# EAGLE schematic punchdriver (EAGLE 6.6.0)

## Sheet 1 of 6
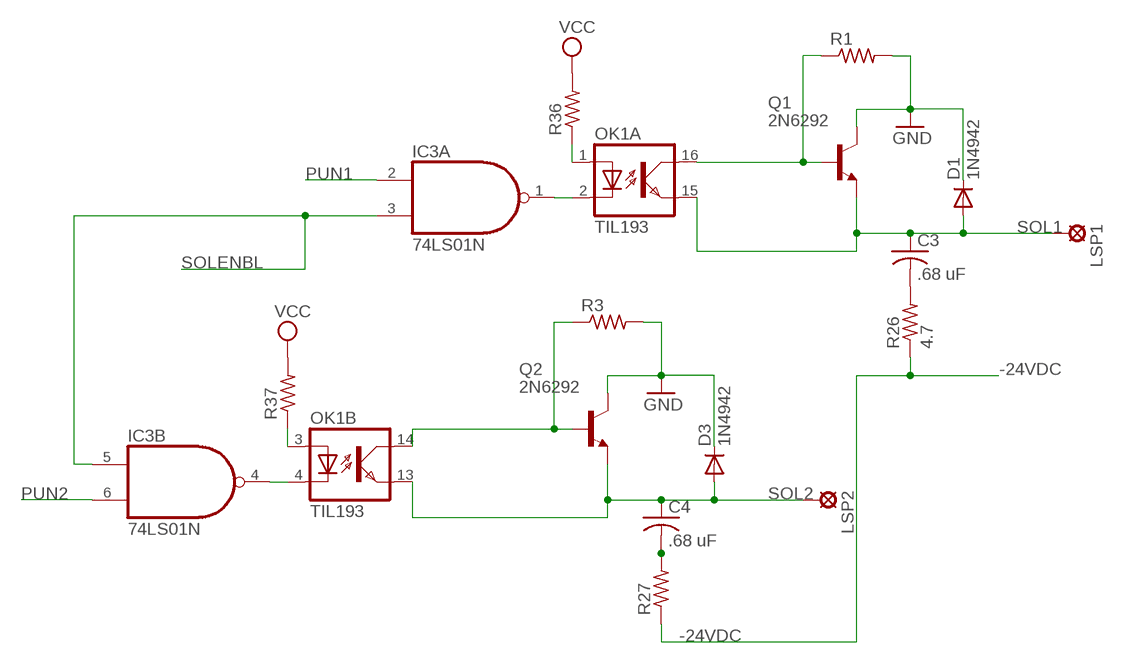
[diagram p0: schematic, sheet 1]

### Parts
C3  .68 uF  C-US050-025X075  [C050-025X075]
C4  .68 uF  C-US050-025X075  [C050-025X075]
D1  1N4942  [DO41-10]
D3  1N4942  [DO41-10]
IC3  74LS01N  [DIL14]
LSP1  SE13  [SE13]
LSP2  SE13  [SE13]
OK1  TIL193  [DIL16]
Q1  2N6292  [TO220]
Q2  2N6292  [TO220]
R1  R-US_0207/10  [0207/10]
R3  R-US_0207/10  [0207/10]
R26  4.7  R-US_0207/10  [0207/10]
R27  R-US_0207/10  [0207/10]
R36  R-US_0207/10  [0207/10]
R37  R-US_0207/10  [0207/10]

### Nets
-24VDC: R26.1 R27.1 ; also sheet 2,3,4,5
GND: D1.C D3.C Q1.2(C) Q2.2(C) R1.2 R3.2 ; also sheet 2,3,4,5,6
N$3: OK1.16(A:COL) Q1.1(B) R1.1
N$4: OK1.14(B:COL) Q2.1(B) R3.1
N$15: C3.2 R26.2
N$18: C4.2 R27.2
N$27: IC3.1(A:O) OK1.2(A:C)
N$28: IC3.4(B:O) OK1.4(B:C)
N$29: OK1.1(A:A) R36.1
N$30: OK1.3(B:A) R37.1
PUN1: IC3.2(A:I0) ; also sheet 6
PUN2: IC3.6(B:I1) ; also sheet 6
SOL1: C3.1 D1.A LSP1.MP OK1.15(A:EMIT) Q1.3(E)
SOL2: C4.1 D3.A LSP2.MP OK1.13(B:EMIT) Q2.3(E)
SOLENBL: IC3.3(A:I1) IC3.5(B:I0) ; also sheet 2,3,4,5
VCC: R36.2 R37.2 ; also sheet 2,3,4,5

## Sheet 2 of 6
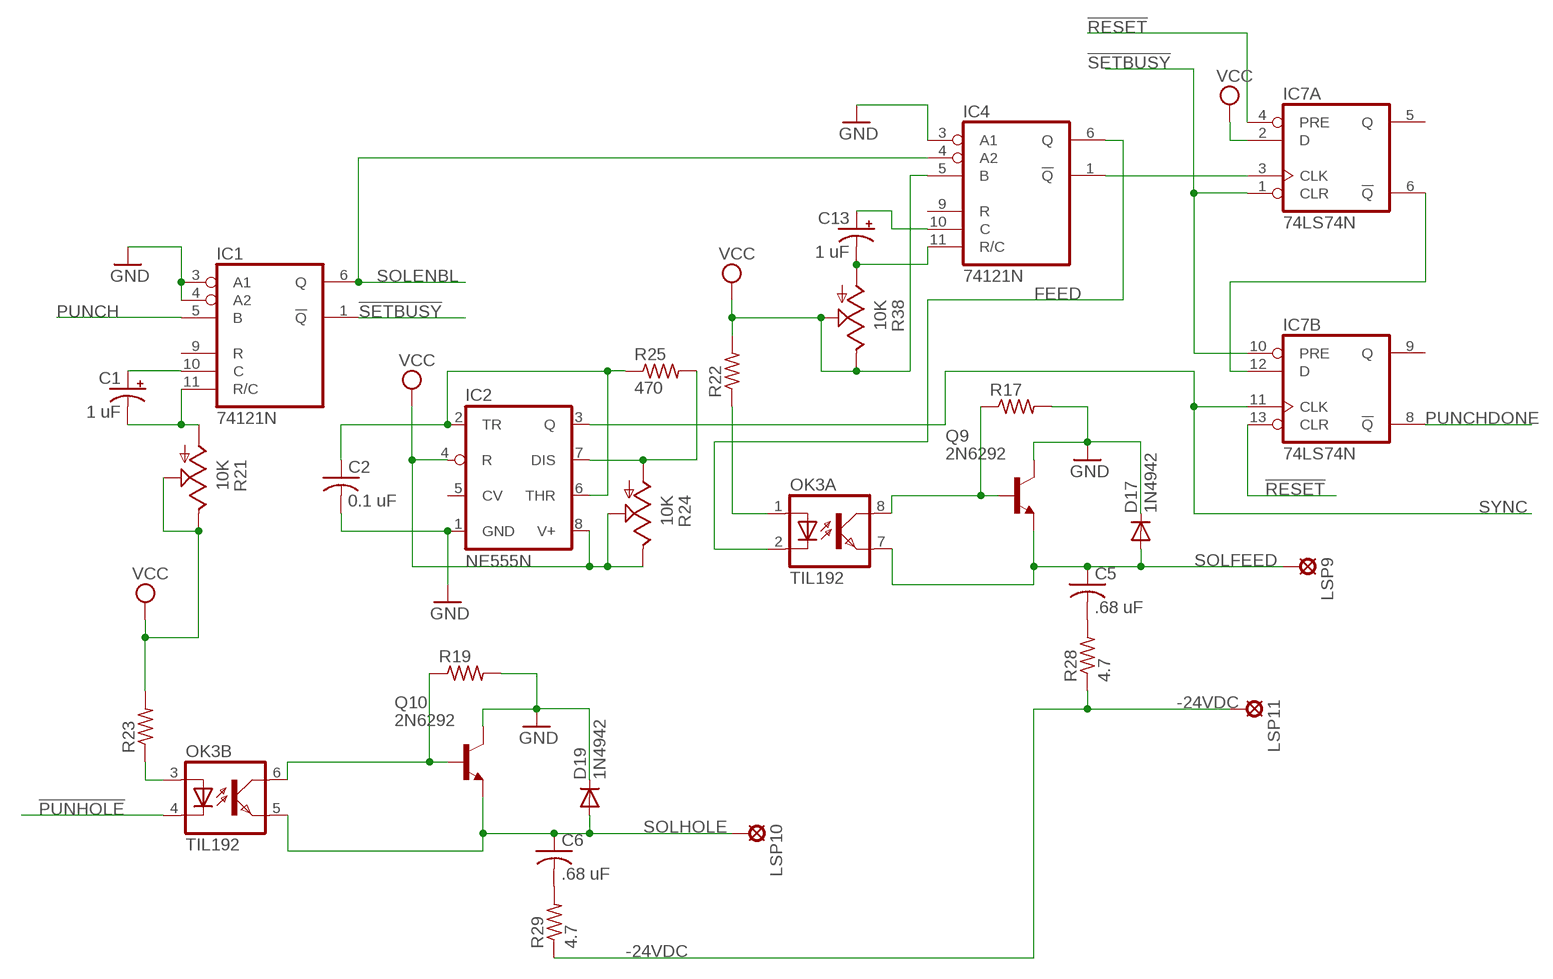
[diagram p1: schematic, sheet 2]

### Parts
C1  1 uF  CPOL-USB45181A  [B45181A]
C2  0.1 uF  C-US050-025X075  [C050-025X075]
C5  .68 uF  C-US050-025X075  [C050-025X075]
C6  .68 uF  C-US050-025X075  [C050-025X075]
C13  1 uF  CPOL-USB45181A  [B45181A]
D17  1N4942  [DO41-10]
D19  1N4942  [DO41-10]
IC1  74121N  [DIL14]
IC2  NE555N  [DIL08]
IC4  74121N  [DIL14]
IC7  74LS74N  [DIL14]
LSP9  SE13  [SE13]
LSP10  SE13  [SE13]
LSP11  SE13  [SE13]
OK3  TIL192  [DIL08]
Q9  2N6292  [TO220]
Q10  2N6292  [TO220]
R17  R-US_0207/10  [0207/10]
R19  R-US_0207/10  [0207/10]
R21  10K  TRIM_US-PTSPIN  [PT-SPIN]
R22  R-US_0207/10  [0207/10]
R23  R-US_0207/10  [0207/10]
R24  10K  TRIM_US-PTSPIN  [PT-SPIN]
R25  470  R-US_0207/10  [0207/10]
R28  4.7  R-US_0207/10  [0207/10]
R29  4.7  R-US_0207/10  [0207/10]
R38  10K  TRIM_US-PTSPIN  [PT-SPIN]

### Nets
!PUNHOLE: OK3.4(B:C)
!RESET: IC7.4(A:PRE) IC7.13(B:CLR)
!SETBUSY: IC1.1(!Q) IC7.1(A:CLR) IC7.10(B:PRE)
-24VDC: LSP11.MP R28.1 R29.1 ; also sheet 1,3,4,5
FEED: IC4.6(Q) OK3.2(A:C)
GND: C2.2 D17.C D19.C IC1.3(A1) IC1.4(A2) IC2.1(GND) IC4.3(A1) Q9.2(C) Q10.2(C) R17.2 R19.2 ; also sheet 1,3,4,5,6
N$1: C1.+ IC1.10(C)
N$6: OK3.8(A:COL) Q9.1(B) R17.1
N$9: IC2.7(DIS) R24.A R25.2
N$10: OK3.6(B:COL) Q10.1(B) R19.1
N$13: OK3.1(A:A) R22.1
N$14: OK3.3(B:A) R23.1
N$16: C1.- IC1.11(R/C) R21.A
N$17: C2.1 IC2.2(TR) IC2.6(THR) R25.1
N$19: C5.2 R28.2
N$20: C6.2 R29.2
N$31: C13.+ IC4.10(C)
N$32: C13.- IC4.11(R/C) R38.A
N$33: IC4.1(!Q) IC7.3(A:CLK)
N$38: IC7.6(A:!Q) IC7.12(B:D)
PUNCH: IC1.5(B)
PUNCHDONE: IC7.8(B:!Q) ; also sheet 6
SOLENBL: IC1.6(Q) IC4.4(A2) ; also sheet 1,3,4,5
SOLFEED: C5.1 D17.A LSP9.MP OK3.7(A:EMIT) Q9.3(E)
SOLHOLE: C6.1 D19.A LSP10.MP OK3.5(B:EMIT) Q10.3(E)
SYNC: IC2.3(Q) IC7.11(B:CLK) ; also sheet 6
VCC: IC2.4(R) IC2.8(V+) IC4.5(B) IC7.2(A:D) R21.E R21.S R22.2 R23.2 R24.E R24.S R38.E R38.S ; also sheet 1,3,4,5
Unconnected: IC1.9(R) IC2.5(CV) IC4.9(R) IC7.5(A:Q) IC7.9(B:Q)

## Sheet 3 of 6
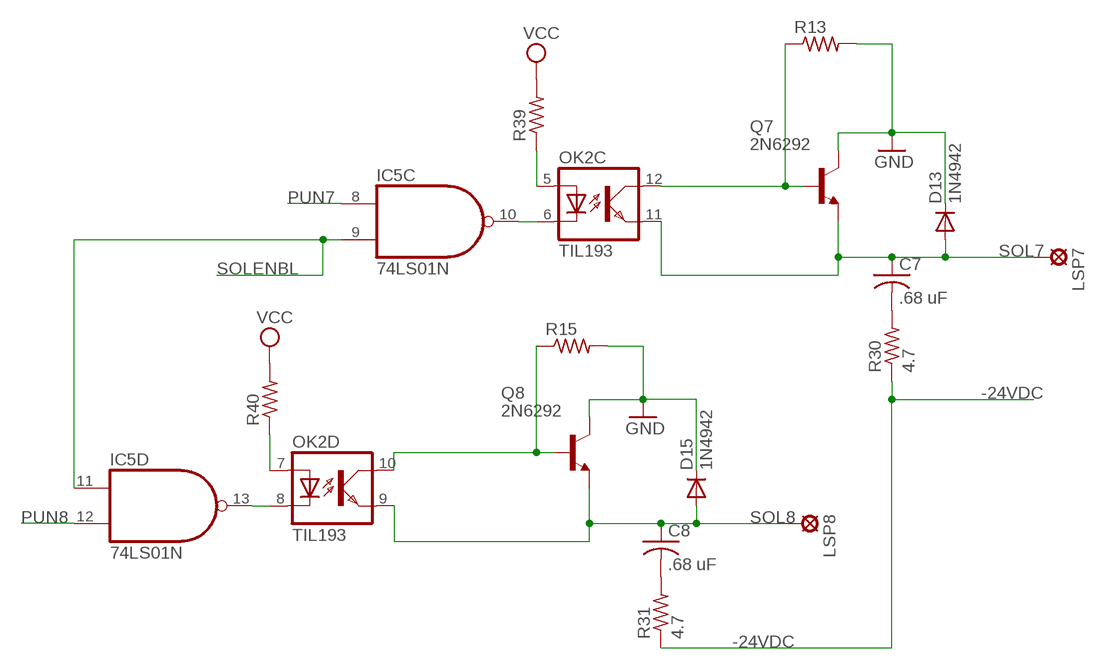
[diagram p2: schematic, sheet 3]

### Parts
C7  .68 uF  C-US050-025X075  [C050-025X075]
C8  .68 uF  C-US050-025X075  [C050-025X075]
D13  1N4942  [DO41-10]
D15  1N4942  [DO41-10]
IC5  74LS01N  [DIL14]
LSP7  SE13  [SE13]
LSP8  SE13  [SE13]
OK2  TIL193  [DIL16]
Q7  2N6292  [TO220]
Q8  2N6292  [TO220]
R13  R-US_0207/10  [0207/10]
R15  R-US_0207/10  [0207/10]
R30  4.7  R-US_0207/10  [0207/10]
R31  4.7  R-US_0207/10  [0207/10]
R39  R-US_0207/10  [0207/10]
R40  R-US_0207/10  [0207/10]

### Nets
-24VDC: R30.1 R31.1 ; also sheet 1,2,4,5
GND: D13.C D15.C Q7.2(C) Q8.2(C) R13.2 R15.2 ; also sheet 1,2,4,5,6
N$11: OK2.12(C:COL) Q7.1(B) R13.1
N$12: OK2.10(D:COL) Q8.1(B) R15.1
N$21: C7.2 R30.2
N$22: C8.2 R31.2
N$40: IC5.13(D:O) OK2.8(D:C)
N$41: IC5.10(C:O) OK2.6(C:C)
N$42: OK2.7(D:A) R40.1
N$43: OK2.5(C:A) R39.1
PUN7: IC5.8(C:I0) ; also sheet 6
PUN8: IC5.12(D:I1) ; also sheet 6
SOL7: C7.1 D13.A LSP7.MP OK2.11(C:EMIT) Q7.3(E)
SOL8: C8.1 D15.A LSP8.MP OK2.9(D:EMIT) Q8.3(E)
SOLENBL: IC5.9(C:I1) IC5.11(D:I0) ; also sheet 1,2,4,5
VCC: R39.2 R40.2 ; also sheet 1,2,4,5

## Sheet 4 of 6
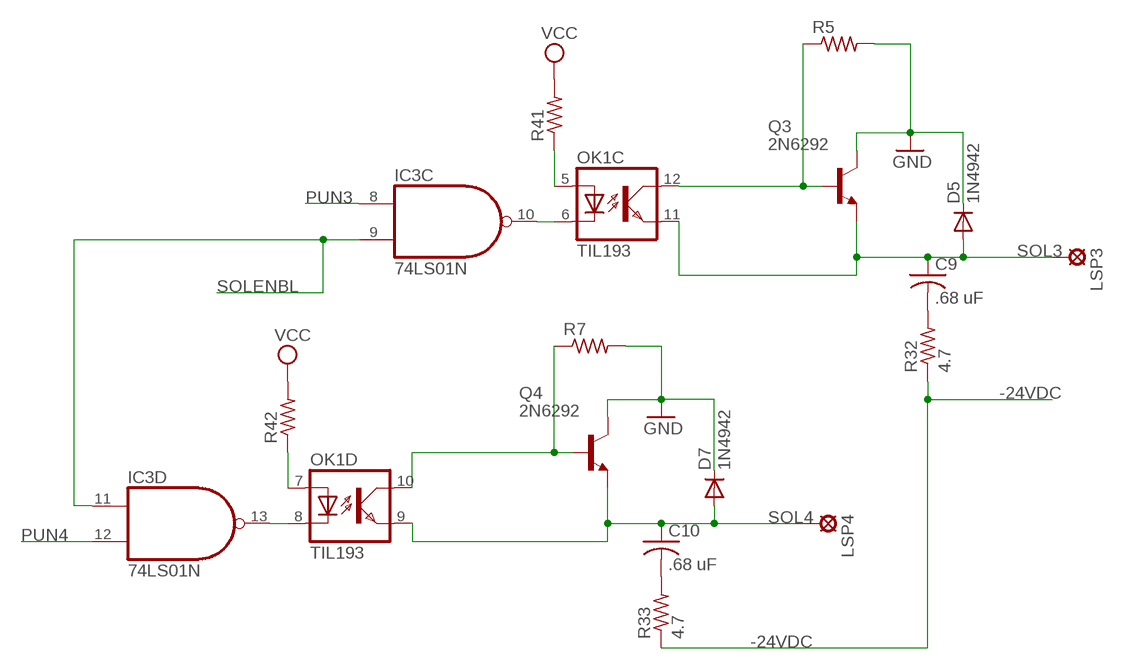
[diagram p3: schematic, sheet 4]

### Parts
C9  .68 uF  C-US050-025X075  [C050-025X075]
C10  .68 uF  C-US050-025X075  [C050-025X075]
D5  1N4942  [DO41-10]
D7  1N4942  [DO41-10]
LSP3  SE13  [SE13]
LSP4  SE13  [SE13]
Q3  2N6292  [TO220]
Q4  2N6292  [TO220]
R5  R-US_0207/10  [0207/10]
R7  R-US_0207/10  [0207/10]
R32  4.7  R-US_0207/10  [0207/10]
R33  4.7  R-US_0207/10  [0207/10]
R41  R-US_0207/10  [0207/10]
R42  R-US_0207/10  [0207/10]

### Nets
-24VDC: R32.1 R33.1 ; also sheet 1,2,3,5
GND: D5.C D7.C Q3.2(C) Q4.2(C) R5.2 R7.2 ; also sheet 1,2,3,5,6
N$5: OK1.12(C:COL) Q3.1(B) R5.1
N$8: OK1.10(D:COL) Q4.1(B) R7.1
N$23: C9.2 R32.2
N$24: C10.2 R33.2
N$35: IC3.10(C:O) OK1.6(C:C)
N$36: IC3.13(D:O) OK1.8(D:C)
N$44: OK1.7(D:A) R42.1
N$45: OK1.5(C:A) R41.1
PUN3: IC3.8(C:I0) ; also sheet 6
PUN4: IC3.12(D:I1) ; also sheet 6
SOL3: C9.1 D5.A LSP3.MP OK1.11(C:EMIT) Q3.3(E)
SOL4: C10.1 D7.A LSP4.MP OK1.9(D:EMIT) Q4.3(E)
SOLENBL: IC3.9(C:I1) IC3.11(D:I0) ; also sheet 1,2,3,5
VCC: R41.2 R42.2 ; also sheet 1,2,3,5

## Sheet 5 of 6
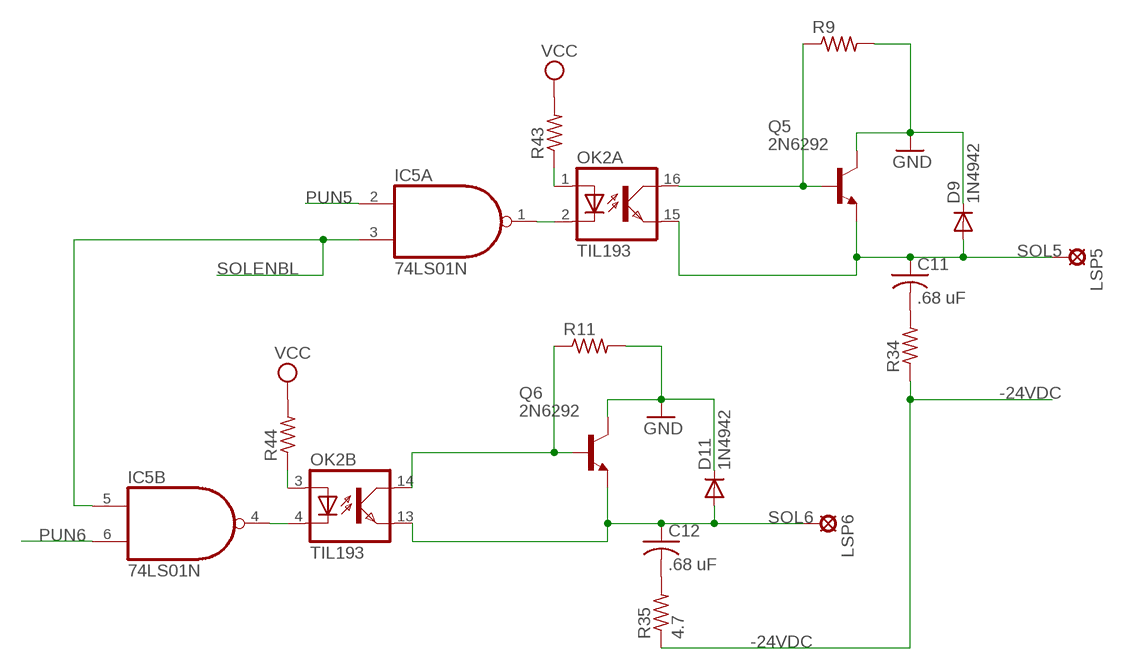
[diagram p4: schematic, sheet 5]

### Parts
C11  .68 uF  C-US050-025X075  [C050-025X075]
C12  .68 uF  C-US050-025X075  [C050-025X075]
D9  1N4942  [DO41-10]
D11  1N4942  [DO41-10]
LSP5  SE13  [SE13]
LSP6  SE13  [SE13]
Q5  2N6292  [TO220]
Q6  2N6292  [TO220]
R9  R-US_0207/10  [0207/10]
R11  R-US_0207/10  [0207/10]
R34  R-US_0207/10  [0207/10]
R35  4.7  R-US_0207/10  [0207/10]
R43  R-US_0207/10  [0207/10]
R44  R-US_0207/10  [0207/10]

### Nets
-24VDC: R34.1 R35.1 ; also sheet 1,2,3,4
GND: D9.C D11.C Q5.2(C) Q6.2(C) R9.2 R11.2 ; also sheet 1,2,3,4,6
N$2: OK2.14(B:COL) Q6.1(B) R11.1
N$7: OK2.16(A:COL) Q5.1(B) R9.1
N$25: C11.2 R34.2
N$26: C12.2 R35.2
N$34: IC5.1(A:O) OK2.2(A:C)
N$37: IC5.4(B:O) OK2.4(B:C)
N$46: OK2.3(B:A) R44.1
N$47: OK2.1(A:A) R43.1
PUN5: IC5.2(A:I0) ; also sheet 6
PUN6: IC5.6(B:I1) ; also sheet 6
SOL5: C11.1 D9.A LSP5.MP OK2.15(A:EMIT) Q5.3(E)
SOL6: C12.1 D11.A LSP6.MP OK2.13(B:EMIT) Q6.3(E)
SOLENBL: IC5.3(A:I1) IC5.5(B:I0) ; also sheet 1,2,3,4
VCC: R43.2 R44.2 ; also sheet 1,2,3,4

## Sheet 6 of 6
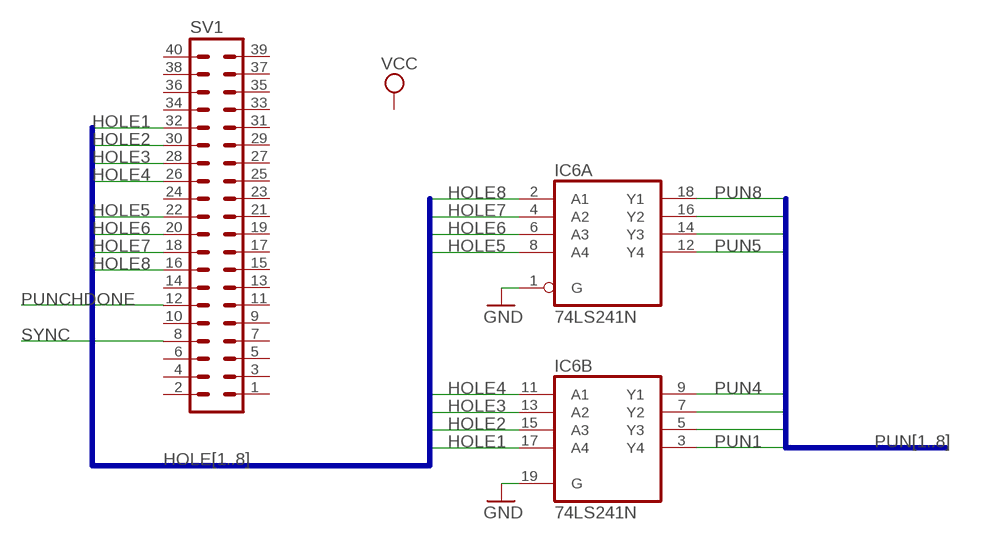
[diagram p5: schematic, sheet 6]

### Parts
IC6  74LS241N  [DIL20]
SV1  MA20-2  [MA20-2]

### Nets
GND: IC6.1(A:G) IC6.19(B:G) ; also sheet 1,2,3,4,5
HOLE1: IC6.17(B:A4) SV1.32
HOLE2: IC6.15(B:A3) SV1.30
HOLE3: IC6.13(B:A2) SV1.28
HOLE4: IC6.11(B:A1) SV1.26
HOLE5: IC6.8(A:A4) SV1.22
HOLE6: IC6.6(A:A3) SV1.20
HOLE7: IC6.4(A:A2) SV1.18
HOLE8: IC6.2(A:A1) SV1.16
PUN1: IC6.3(B:Y4) ; also sheet 1
PUN2: IC6.5(B:Y3) ; also sheet 1
PUN3: IC6.7(B:Y2) ; also sheet 4
PUN4: IC6.9(B:Y1) ; also sheet 4
PUN5: IC6.12(A:Y4) ; also sheet 5
PUN6: IC6.14(A:Y3) ; also sheet 5
PUN7: IC6.16(A:Y2) ; also sheet 3
PUN8: IC6.18(A:Y1) ; also sheet 3
PUNCHDONE: SV1.12 ; also sheet 2
SYNC: SV1.8 ; also sheet 2
Unconnected: SV1.1 SV1.2 SV1.3 SV1.4 SV1.5 SV1.6 SV1.7 SV1.9 SV1.10 SV1.11 SV1.13 SV1.14 SV1.15 SV1.17 SV1.19 SV1.21 SV1.23 SV1.24 SV1.25 SV1.27 SV1.29 SV1.31 SV1.33 SV1.34 SV1.35 SV1.36 SV1.37 SV1.38 SV1.39 SV1.40

### Buses
PUN[1..8]
HOLE[1..8]

## Power pins joined to a net without a drawn wire
GND: IC1.7(GND) IC3.7(P:GND) IC4.7(GND) IC5.7(P:GND) IC6.10(P:GND) IC7.7(P:GND)
VCC: IC1.14(VCC) IC3.14(P:VCC) IC4.14(VCC) IC5.14(P:VCC) IC6.20(P:VCC) IC7.14(P:VCC)

## Library data of the parts
C1 C13 = rcl:CPOL-US: POLARIZED CAPACITOR, American symbol
C2-C12 = rcl:C-US: CAPACITOR, American symbol
D1 D3 D5 D7 D9 D11 D13 D15 D17 D19 = diode:1N4942: DIODE 1.0 A, 200 V, 150 ns
IC1 IC4 = 74xx-us:74*121: Monostable MULTIVIBRATOR, schmitt trigger inputs
IC2 = linear:*555: TIMER
IC3 IC5 = 74xx-us:74*01: Quad 2-input NAND gate, open collector
IC6 = 74xx-us:74*241: Octal BUFFER and LINE DRIVER, 3-state
IC7 = 74xx-us:74*74: Dual D type positive edge triggered FLIP FLOP, preset and clear
LSP1-LSP11 = solpad:SE13: SOLDER PAD E1542, drill 1,3mm, distributor Buerklin, 07F815
OK1 OK2 = optocoupler:TIL193: TEXAS INSTRUMENTS OPTO COUPLER; OC_FARNELL: 1683365; OC_NEWARK: unknown
OK3 = optocoupler:TIL192: TEXAS INSTRUMENTS OPTO COUPLER; OC_FARNELL: 1683364; OC_NEWARK: unknown
Q1-Q10 = transistor-npn:2N6292: NPN Transistor
R1 R3 R5 R7 R9 R11 R13 R15 R17 R19 R22 R23 R25-R37 R39-R44 = rcl:R-US_: RESISTOR, American symbol
R21 R24 R38 = pot:TRIM_US-: POTENTIOMETER
SV1 = con-lstb:MA20-2: PIN HEADER; OC_FARNELL: unknown; OC_NEWARK: unknown